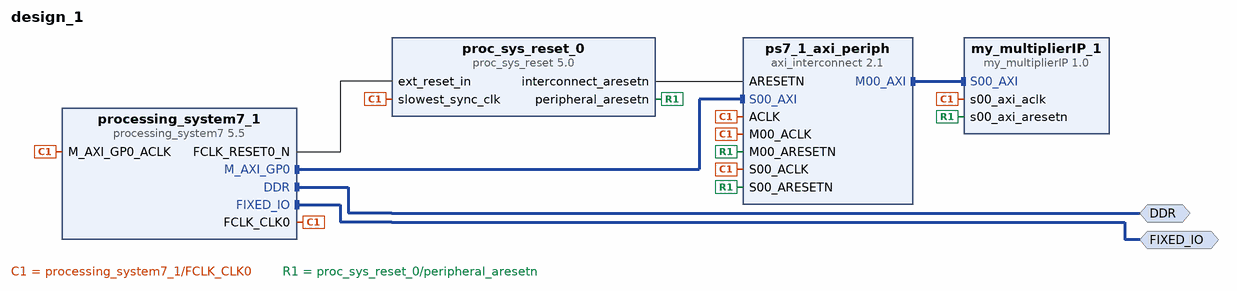
[diagram p0: block diagram of the top level]
# Vivado block design design_1, xc7z020clg484-1, Vivado 2017.1
create_bd_design design_1

create_bd_intf_port -mode Master -vlnv xilinx.com:interface:ddrx_rtl:1.0 DDR
create_bd_intf_port -mode Master -vlnv xilinx.com:display_processing_system7:fixedio_rtl:1.0 FIXED_IO

create_bd_cell -type ip -vlnv user.org:user:my_multiplierIP:1.0 my_multiplierIP_1
create_bd_cell -type ip -vlnv xilinx.com:ip:proc_sys_reset:5.0 proc_sys_reset_0
create_bd_cell -type ip -vlnv xilinx.com:ip:processing_system7:5.5 processing_system7_1
set_property -dict [list \
  CONFIG.PCW_QSPI_GRP_SINGLE_SS_ENABLE 1 \
  CONFIG.PCW_USB0_PERIPHERAL_ENABLE 0 \
  CONFIG.preset ZedBoard \
] [get_bd_cells processing_system7_1]
create_bd_cell -type ip -vlnv xilinx.com:ip:axi_interconnect:2.1 ps7_1_axi_periph
set_property -dict {CONFIG.NUM_MI 1} [get_bd_cells ps7_1_axi_periph]

# ---- connections ----

connect_bd_intf_net [get_bd_intf_pins processing_system7_1/M_AXI_GP0] [get_bd_intf_pins ps7_1_axi_periph/S00_AXI]
connect_bd_intf_net [get_bd_intf_pins ps7_1_axi_periph/M00_AXI] [get_bd_intf_pins my_multiplierIP_1/S00_AXI]
connect_bd_intf_net [get_bd_intf_ports DDR] [get_bd_intf_pins processing_system7_1/DDR]
connect_bd_intf_net [get_bd_intf_ports FIXED_IO] [get_bd_intf_pins processing_system7_1/FIXED_IO]
connect_bd_net [get_bd_pins processing_system7_1/FCLK_CLK0] \
  [get_bd_pins proc_sys_reset_0/slowest_sync_clk] [get_bd_pins processing_system7_1/M_AXI_GP0_ACLK] \
  [get_bd_pins my_multiplierIP_1/s00_axi_aclk] [get_bd_pins ps7_1_axi_periph/ACLK] [get_bd_pins ps7_1_axi_periph/S00_ACLK] \
  [get_bd_pins ps7_1_axi_periph/M00_ACLK]
connect_bd_net [get_bd_pins proc_sys_reset_0/interconnect_aresetn] [get_bd_pins ps7_1_axi_periph/ARESETN]
connect_bd_net [get_bd_pins processing_system7_1/FCLK_RESET0_N] [get_bd_pins proc_sys_reset_0/ext_reset_in]
connect_bd_net [get_bd_pins proc_sys_reset_0/peripheral_aresetn] \
  [get_bd_pins my_multiplierIP_1/s00_axi_aresetn] [get_bd_pins ps7_1_axi_periph/S00_ARESETN] \
  [get_bd_pins ps7_1_axi_periph/M00_ARESETN]

# ---- address map ----
assign_bd_address -offset 0x43C00000 -range 64K -target_address_space [get_bd_addr_spaces processing_system7_1/Data] [get_bd_addr_segs my_multiplierIP_1/S00_AXI/S00_AXI_reg]

validate_bd_design
save_bd_design
